# EAGLE schematic encoder_isolator (EAGLE 9.6.1)
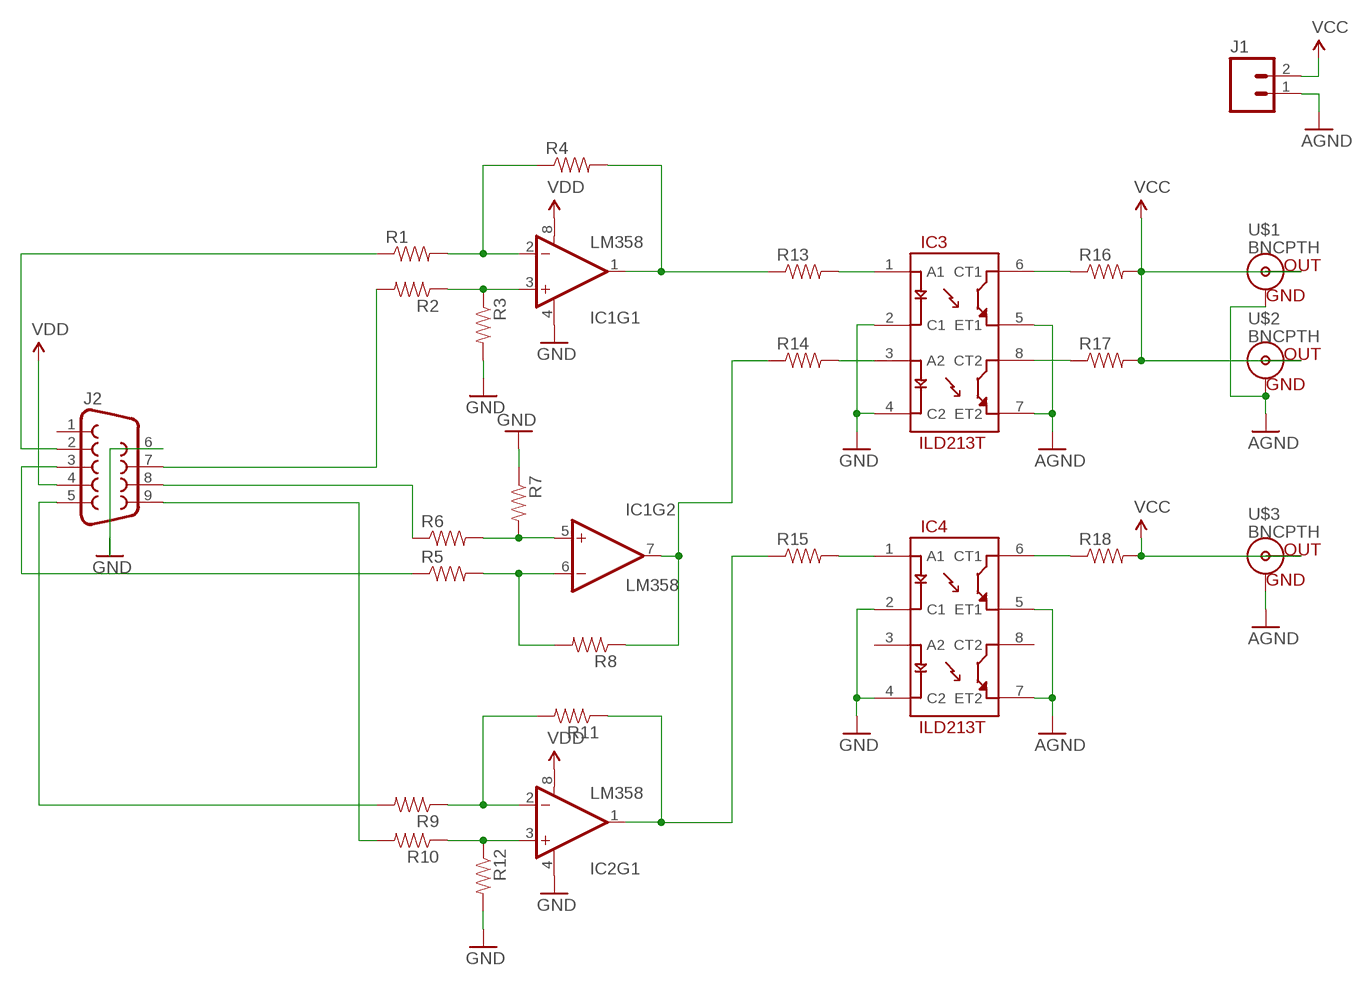
[diagram p0: schematic, sheet 1]

## Parts
IC1  LM358  [DIP08]
IC2  LM358  [DIP08]
IC3  ILD213T  [SO08]
IC4  ILD213T  [SO08]
J1  M02POLAR  [MOLEX-1X2]
J2  DB9FEMALE  [DB9]
R1  RESISTORPTH-1/4W  [AXIAL-0.4]
R2  RESISTORPTH-1/4W  [AXIAL-0.4]
R3  RESISTORPTH-1/4W  [AXIAL-0.4]
R4  RESISTORPTH-1/4W  [AXIAL-0.4]
R5  RESISTORPTH-1/4W  [AXIAL-0.4]
R6  RESISTORPTH-1/4W  [AXIAL-0.4]
R7  RESISTORPTH-1/4W  [AXIAL-0.4]
R8  RESISTORPTH-1/4W  [AXIAL-0.4]
R9  RESISTORPTH-1/4W  [AXIAL-0.4]
R10  RESISTORPTH-1/4W  [AXIAL-0.4]
R11  RESISTORPTH-1/4W  [AXIAL-0.4]
R12  RESISTORPTH-1/4W  [AXIAL-0.4]
R13  RESISTORPTH-1/4W  [AXIAL-0.4]
R14  RESISTORPTH-1/4W  [AXIAL-0.4]
R15  RESISTORPTH-1/4W  [AXIAL-0.4]
R16  RESISTORPTH-1/4W  [AXIAL-0.4]
R17  RESISTORPTH-1/4W  [AXIAL-0.4]
R18  RESISTORPTH-1/4W  [AXIAL-0.4]
U$1  BNCPTH  [BNC]
U$2  BNCPTH  [BNC]
U$3  BNCPTH  [BNC]

## Nets
AGND: IC3.5(ET1) IC3.7(ET2) IC4.5(ET1) IC4.7(ET2) J1.1 U$1.GND U$2.GND U$3.GND
GND: IC1.4(V-) IC2.4(V-) IC3.2(C1) IC3.4(C2) IC4.2(C1) IC4.4(C2) J2.6 R3.P$2 R7.P$1 R12.P$2
N$1: IC2.3(+IN) R10.P$1 R12.P$1
N$2: IC1.3(+IN) R2.P$1 R3.P$1
N$3: IC1.2(-IN) R1.P$2 R4.P$1
N$4: IC1.1(OUT) R4.P$2 R13.P$1
N$5: IC1.5(+IN) R6.P$2 R7.P$2
N$6: IC1.6(-IN) R5.P$2 R8.P$2
N$7: IC1.7(OUT) R8.P$1 R14.P$1
N$8: IC2.2(-IN) R9.P$1 R11.P$2
N$9: IC2.1(OUT) R11.P$1 R15.P$1
N$10: IC3.1(A1) R13.P$2
N$11: IC3.3(A2) R14.P$2
N$12: IC4.1(A1) R15.P$2
N$13: IC4.6(CT1) R18.P$1
N$14: IC3.8(CT2) R17.P$1
N$15: IC3.6(CT1) R16.P$1
N$16: J2.7 R2.P$2
N$17: J2.8 R6.P$1
N$18: J2.9 R10.P$2
N$19: J2.2 R1.P$1
N$20: J2.3 R5.P$1
N$21: J2.5 R9.P$2
VCC: J1.2 R16.P$2 R17.P$2 R18.P$2 U$1.S(OUT) U$2.S(OUT) U$3.S(OUT)
VDD: IC1.8(V+) IC2.8(V+) J2.4
Unconnected: IC2.5(+IN) IC2.6(-IN) IC2.7(OUT) IC4.3(A2) IC4.8(CT2) J2.1

## Library data of the parts
IC1 IC2 = SparkFun-AnalogIC:LM358: Jellybean op-amp; PROD_ID: IC-09172
IC3 IC4 = SparkFun-DiscreteSemi:ILD213T: Dual optoisolator.
J1 = SparkFun-Connectors:M02: Standard 2-pin 0.1" header. Use with - straight break away headers ( PRT-00116) - right angle break away headers (PRT-00553) - swiss pins (PRT-00743) - machine pins (PRT-00117) - female headers (PRT-00115) Molex polarized connector foot print use with: PRT-08233 with associated crimp pins and housings. 2.54_SCREWTERM for use with PRT-10571. 3.5mm Screw Terminal footprints for PRT-08084 5mm Screw Terminal footprints for use with PRT-08432
J2 = SparkFun-Connectors:DB9: DB9 Connector Standard DB9 (D-Sub 9) serial connector. Can be used for CAN bus as well as RS485 and RS232. Footprint production proven. Spark Fun Electronics SKU : PRT-00429; PROD_ID: CONN-08194
R1-R18 = SparkFun-Passives:RESISTOR: Resistor Basic schematic elements and footprints for 0603, 1206, and PTH resistors.
U$1-U$3 = SparkFun-Connectors:BNC: BNC Connector, Mouser Part# 5227161